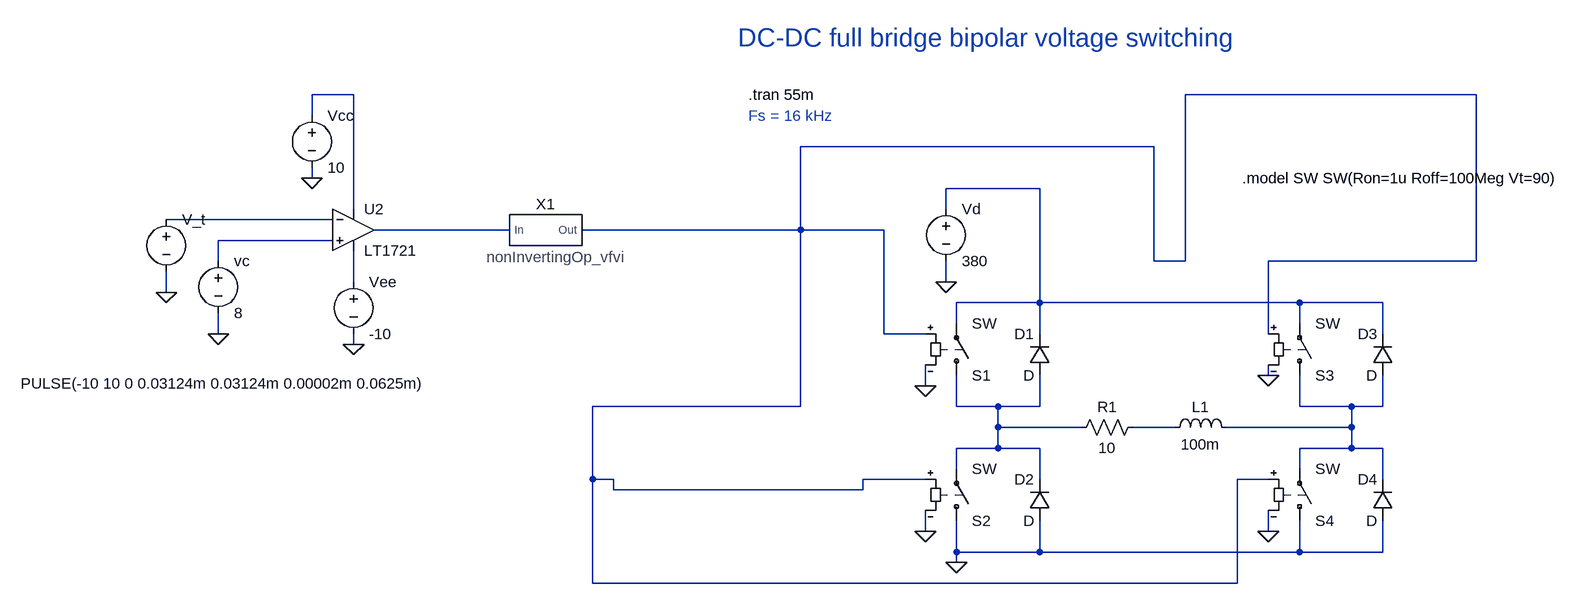
[diagram p0: schematic DCDC-full-bridge.asc]
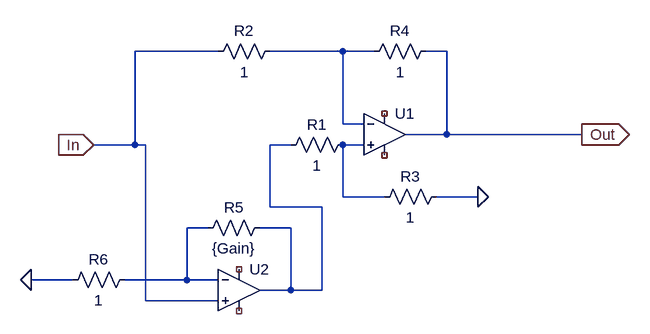
[diagram p1: sub-circuit noninvertingopamp_vfvi.asc]
DCDC-full-bridge.asc, the LTspice schematic file:
Version 4.1
SHEET 1 1180 680
WIRE -720 -288 -784 -288
WIRE 1008 -288 560 -288
WIRE -784 -256 -784 -288
WIRE 512 -208 -32 -208
WIRE -784 -160 -784 -176
WIRE 336 -144 192 -144
WIRE -720 -112 -720 -288
WIRE 192 -112 192 -144
WIRE -752 -96 -1008 -96
WIRE -480 -80 -688 -80
WIRE -32 -80 -32 -208
WIRE -32 -80 -368 -80
WIRE 96 -80 -32 -80
WIRE -752 -64 -928 -64
WIRE -928 -32 -928 -64
WIRE 512 -32 512 -208
WIRE 560 -32 560 -288
WIRE 560 -32 512 -32
WIRE 1008 -32 1008 -288
WIRE 1008 -32 688 -32
WIRE -720 0 -720 -48
WIRE 192 0 192 -32
WIRE -1008 16 -1008 -16
WIRE 336 32 336 -144
WIRE 336 32 208 32
WIRE 736 32 336 32
WIRE 864 32 736 32
WIRE 208 64 208 32
WIRE 736 64 736 32
WIRE -928 80 -928 48
WIRE 96 80 96 -80
WIRE 160 80 96 80
WIRE 336 80 336 32
WIRE 688 80 688 -32
WIRE 864 80 864 32
WIRE -720 96 -720 80
WIRE 688 144 688 128
WIRE 160 160 160 128
WIRE -32 192 -32 -80
WIRE -32 192 -352 192
WIRE 208 192 208 144
WIRE 272 192 208 192
WIRE 336 192 336 144
WIRE 336 192 272 192
WIRE 736 192 736 144
WIRE 816 192 736 192
WIRE 864 192 864 144
WIRE 864 192 816 192
WIRE 272 224 272 192
WIRE 400 224 272 224
WIRE 544 224 480 224
WIRE 816 224 816 192
WIRE 816 224 624 224
WIRE 272 256 272 224
WIRE 272 256 208 256
WIRE 336 256 272 256
WIRE 816 256 816 224
WIRE 816 256 736 256
WIRE 864 256 816 256
WIRE 208 288 208 256
WIRE 736 288 736 256
WIRE -352 304 -352 192
WIRE -320 304 -352 304
WIRE 160 304 64 304
WIRE 336 304 336 256
WIRE 688 304 640 304
WIRE 864 304 864 256
WIRE -320 320 -320 304
WIRE 64 320 64 304
WIRE 64 320 -320 320
WIRE 160 384 160 352
WIRE 688 384 688 352
WIRE 208 416 208 368
WIRE 336 416 336 368
WIRE 336 416 208 416
WIRE 736 416 736 368
WIRE 736 416 336 416
WIRE 864 416 864 368
WIRE 864 416 736 416
WIRE 208 432 208 416
WIRE -352 464 -352 304
WIRE 640 464 640 304
WIRE 640 464 -352 464
FLAG 192 0 0
FLAG 688 384 0
FLAG 688 144 0
FLAG 208 432 0
FLAG 160 384 0
FLAG 160 160 0
FLAG -784 -160 0
FLAG -720 96 0
FLAG -928 80 0
FLAG -1008 16 0
SYMBOL sw 208 160 M180
SYMATTR InstName S1
SYMBOL voltage 192 -128 R0
WINDOW 123 0 0 Left 0
WINDOW 39 0 0 Left 0
SYMATTR InstName Vd
SYMATTR Value 380
SYMBOL diode 352 144 R180
WINDOW 0 24 64 Left 2
WINDOW 3 24 0 Left 2
SYMATTR InstName D1
SYMBOL diode 352 368 R180
WINDOW 0 24 64 Left 2
WINDOW 3 24 0 Left 2
SYMATTR InstName D2
SYMBOL sw 208 384 M180
SYMATTR InstName S2
SYMBOL diode 880 144 R180
WINDOW 0 24 64 Left 2
WINDOW 3 24 0 Left 2
SYMATTR InstName D3
SYMBOL sw 736 160 M180
SYMATTR InstName S3
SYMBOL diode 880 368 R180
WINDOW 0 24 64 Left 2
WINDOW 3 24 0 Left 2
SYMATTR InstName D4
SYMBOL sw 736 384 M180
SYMATTR InstName S4
SYMBOL res 384 240 R270
WINDOW 0 32 56 VTop 2
WINDOW 3 0 56 VBottom 2
SYMATTR InstName R1
SYMATTR Value 10
SYMBOL ind 528 240 R270
WINDOW 0 32 56 VTop 2
WINDOW 3 5 56 VBottom 2
SYMATTR InstName L1
SYMATTR Value 100m
SYMBOL voltage -1008 -112 R0
WINDOW 3 -224 268 Left 2
WINDOW 123 0 0 Left 0
WINDOW 39 0 0 Left 0
SYMATTR Value PULSE(-10 10 0 0.03124m 0.03124m 0.00002m 0.0625m)
SYMATTR InstName V_t
SYMBOL voltage -928 -48 R0
WINDOW 123 0 0 Left 0
WINDOW 39 0 0 Left 0
SYMATTR InstName vc
SYMATTR Value 8
SYMBOL Comparators\\LT1721 -720 -144 R0
SYMATTR InstName U2
SYMBOL voltage -784 -272 R0
WINDOW 123 0 0 Left 0
WINDOW 39 0 0 Left 0
SYMATTR InstName Vcc
SYMATTR Value 10
SYMBOL voltage -720 -16 R0
WINDOW 123 0 0 Left 0
WINDOW 39 0 0 Left 0
SYMATTR InstName Vee
SYMATTR Value -10
SYMBOL noninvertingOpAmp_vfvi -432 -80 R0
SYMATTR InstName X1
SYMATTR SpiceLine Gain=10
TEXT 648 -160 Left 2 !.model SW SW(Ron=1u Roff=100Meg Vt=90)
TEXT -112 -288 Left 2 !.tran 55m
TEXT -128 -376 Left 4 ;DC-DC full bridge bipolar voltage switching
TEXT -112 -256 Left 2 ;Fs = 16 kHz

noninvertingopamp_vfvi.asc, the sub-circuit schematic file:
Version 4.1
SHEET 1 880 680
WIRE -64 -64 -192 -64
WIRE 128 -64 16 -64
WIRE 176 -64 128 -64
WIRE 288 -64 256 -64
WIRE 128 48 128 -64
WIRE 160 48 128 48
WIRE 288 64 288 -64
WIRE 288 64 224 64
WIRE 496 64 288 64
WIRE -192 80 -192 -64
WIRE -192 80 -256 80
WIRE -176 80 -192 80
WIRE 48 80 16 80
WIRE 160 80 128 80
WIRE 128 160 128 80
WIRE 192 160 128 160
WIRE 336 160 272 160
WIRE 16 176 16 80
WIRE 96 176 16 176
WIRE -80 208 -112 208
WIRE 48 208 0 208
WIRE -288 288 -352 288
WIRE -112 288 -112 208
WIRE -112 288 -208 288
WIRE -64 288 -112 288
WIRE 48 304 48 208
WIRE 48 304 0 304
WIRE 96 304 96 176
WIRE 96 304 48 304
WIRE -176 320 -176 80
WIRE -64 320 -176 320
FLAG 336 160 0
FLAG 496 64 Out
IOPIN 496 64 Out
FLAG -256 80 In
IOPIN -256 80 In
FLAG -352 288 0
SYMBOL OpAmps\\UniversalOpAmp 192 64 R0
SYMATTR InstName U1
SYMBOL res 144 64 R90
WINDOW 0 0 56 VBottom 2
WINDOW 3 32 56 VTop 2
SYMATTR InstName R1
SYMATTR Value 1
SYMBOL res -80 -48 R270
WINDOW 0 32 56 VTop 2
WINDOW 3 0 56 VBottom 2
SYMATTR InstName R2
SYMATTR Value 1
SYMBOL res 288 144 R90
WINDOW 0 0 56 VBottom 2
WINDOW 3 32 56 VTop 2
SYMATTR InstName R3
SYMATTR Value 1
SYMBOL res 272 -80 R90
WINDOW 0 0 56 VBottom 2
WINDOW 3 32 56 VTop 2
SYMATTR InstName R4
SYMATTR Value 1
SYMBOL res 16 192 R90
WINDOW 0 0 56 VBottom 2
WINDOW 3 32 56 VTop 2
SYMATTR InstName R5
SYMATTR Value {Gain}
SYMBOL res -192 272 R90
WINDOW 0 0 56 VBottom 2
WINDOW 3 32 56 VTop 2
SYMATTR InstName R6
SYMATTR Value 1
SYMBOL OpAmps\\UniversalOpAmp -32 304 R0
SYMATTR InstName U2

The netlist it stands for:
* DCDC-full-bridge.asc
S1 N008 N003 N002 0 SW
Vd N003 0 380
D1 N008 N003 D
D2 0 N008 D
S2 0 N008 N002 0 SW
D3 N009 N003 D
S3 N009 N003 N002 0 SW
D4 0 N009 D
S4 0 N009 N002 0 SW
R1 N008 N010 10
L1 N010 N009 100m
V_t N004 0 PULSE(-10 10 0 0.03124m 0.03124m 0.00002m 0.0625m)
vc N006 0 8
X§U2 N006 N004 N001 N007 N005 LT1720  ; LT1721, pins In+ In- V+ V- OUT
Vcc N001 0 10
Vee N007 0 -10
X§X1 N005 N002 noninvertingopamp_vfvi params: Gain=10

* block symbol definitions
.subckt noninvertingopamp_vfvi In Out
X§U1 N003 N001 NC_01 NC_02 Out level1 Avol=1Meg GBW=10Meg Vos=0 En=0 Enk=0 In=0 Ink=0 Rin=500Meg  ; pins In+ In- V+ V- OUT
R1 N003 N002 1
R2 In N001 1
R3 0 N003 1
R4 Out N001 1
R5 N002 N004 {Gain}
R6 N004 0 1
X§U2 In N004 NC_03 NC_04 N002 level1 Avol=1Meg GBW=10Meg Vos=0 En=0 Enk=0 In=0 Ink=0 Rin=500Meg  ; pins In+ In- V+ V- OUT
.ends noninvertingopamp_vfvi

.model D D
.lib standard.dio
.model SW SW(Ron=1u Roff=100Meg Vt=90)
.tran 55m
* DC-DC full bridge bipolar voltage switching
* Fs = 16 kHz
.lib LTC.lib
.lib UniversalOpAmp1.lib
.backanno
.end